# EAGLE design Grove - Button x2 (EAGLE 7.3.0)
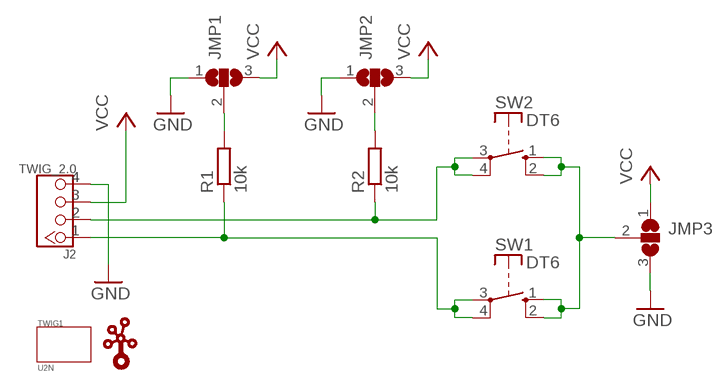
[diagram p0: schematic, sheet 1]

## Parts
J2  TWIG_2.0  [2.0_1X4]
JMP1  SJ2W  [SJ_2]
JMP2  SJ2W  [SJ_2]
JMP3  SJ2W  [SJ_2]
R1  10k  R-EU_R0805  [R0805]
R2  10k  R-EU_R0805  [R0805]
SW1  DT6  [DT6]
SW2  DT6  [DT6]
TWIG1  U2N  [U2N]
U$1  TWIGLOGOTWIGLOGO_SMALL  [TWIGLOGO_SMALL]

## Nets
GND: J2.4 JMP1.1 JMP2.1 JMP3.3
N$1: J2.2 R2.1 SW2.3(P) SW2.4(P)
N$2: J2.1 R1.1 SW1.3(P) SW1.4(P)
N$3: JMP2.2 R2.2
N$4: JMP3.2 SW1.1(S) SW1.2(S) SW2.1(S) SW2.2(S)
N$6: JMP1.2 R1.2
VCC: J2.3 JMP1.3 JMP2.3 JMP3.1

## Library data of the parts
J2 = CONNECTER:TWIG_2.0
JMP1-JMP3 = jumper:SJ2W: SMD solder JUMPER
R1 R2 = rcl:R-EU_: RESISTOR, European symbol
SW1 SW2 = switch-misc:DT: ITT SWITCH
TWIG1 = twig_template1:U2N
U$1 = seeedleo:TWIGLOGO

## Board
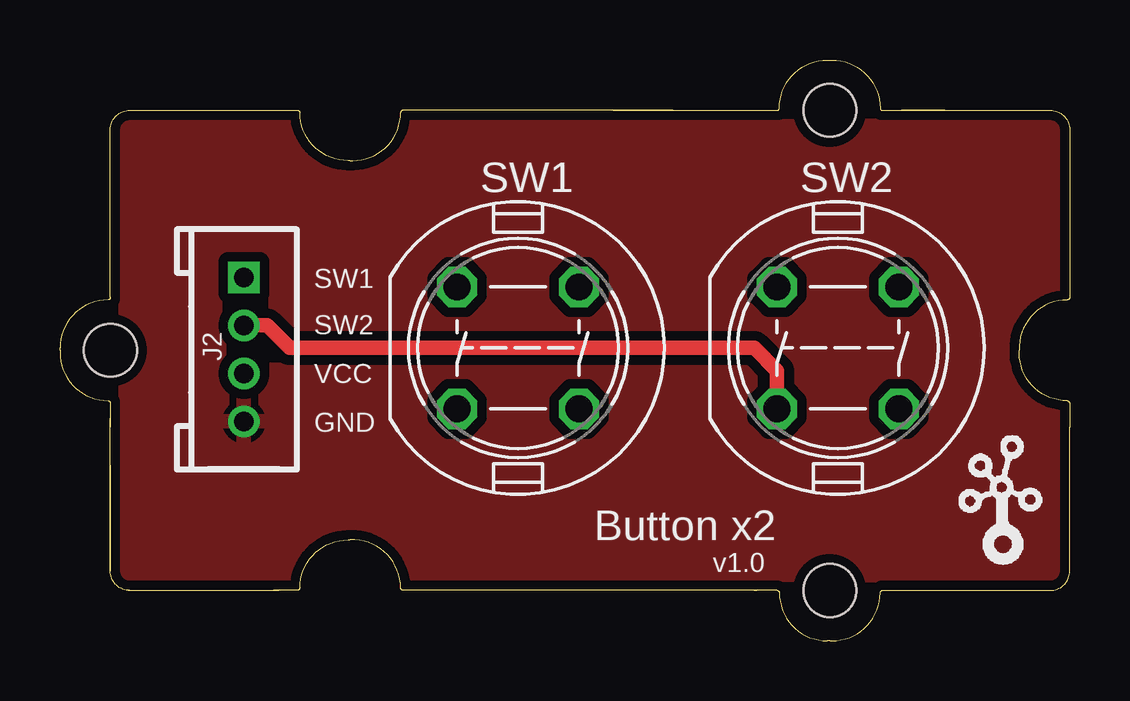
[diagram p1: board, top side]
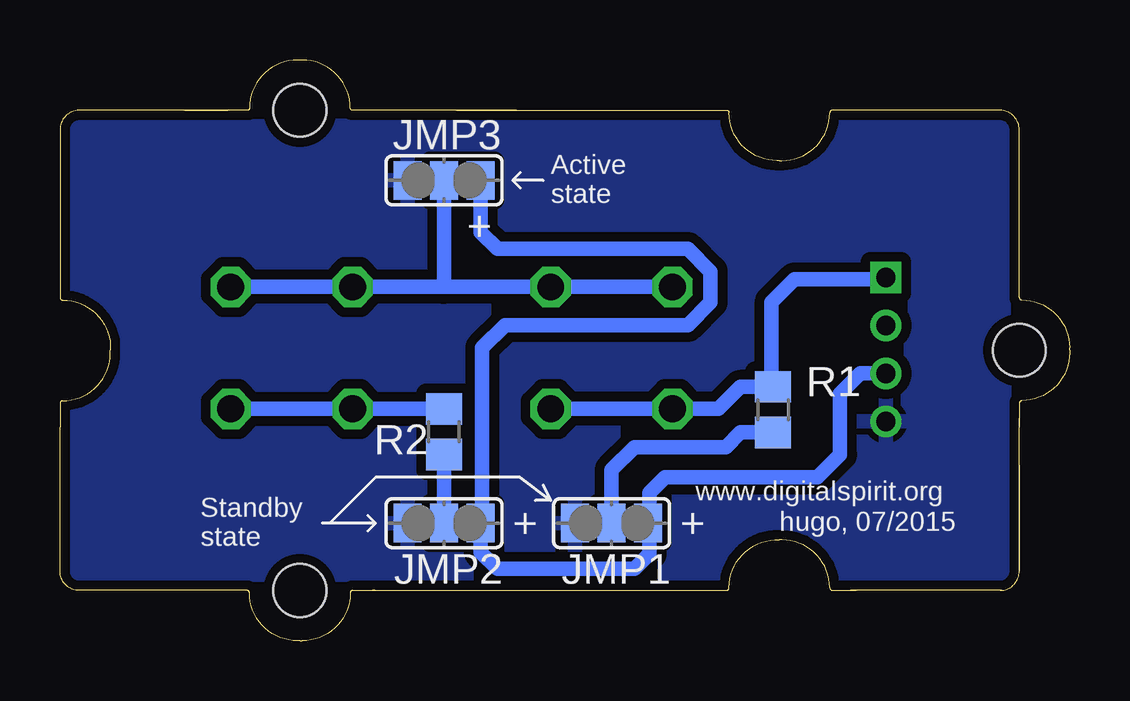
[diagram p2: board, bottom side, seen from below]

Size 42.09 x 24.2 mm. Coordinates in mm from the lower left corner, seen from the top.
Copper layers (1*16): Top 0.035mm / dielectric 1.5mm / Bottom 0.035mm
Design rules "SeeedStudio_rule_no_angle_090911": minimum track width 6mil, minimum drill 12mil, track to track 6mil, track to pad 6mil, pad to pad 6mil, via to via 6mil, smd to smd 0mil, copper to edge 10mil, drill to drill 10mil, minimum pad ring 10mil, minimum via ring 6mil, stop-mask expansion 2mil, vias tented up to drill 100mil, thermal gap 10mil

### Footprints (pad centres in the part's own frame; a part is rotated, then mirrored left to right if it is on the bottom)
2.0_1X4 = drill 0.8 pad 1.27 square: 1 -3,0 | drill 0.8 pad 1.27: 2 -1,0; 3 1,0; 4 3,0
SJ_2 = smd 1.168 x 1.6: 1 -1.524,0; 2 0,0; 3 1.524,0
R0805 = smd 1.3 x 1.5: 1 -0.95,0; 2 0.95,0
DT6 = drill 1.118 octagon: 1 -2.54,2.54; 2 2.54,2.54; 3 2.54,-2.54; 4 -2.54,-2.54
U2N = hole 2.2: 10.453,-10.42; 10.453,9.58; -19.535,-0.415

### Placement (x,y rotation side)
J2  7.67,12.14 270 top
JMP1  19.1,4.9 0 bottom
JMP2  26.08,4.9 0 bottom
JMP3  26.08,19.19 180 bottom
R1  12.36,9.63 270 bottom
R2  26.08,8.71 270 bottom
SW1  19.1,12.2 0 top
SW2  32.43,12.2 0 top
TWIG1  21.64,12.52 0 top
U$1  37.07,3.05 0 top

### Tracks (layer width: path | path; a pad name or v marks a point on that pad's centre or on a via)
GND
  pour Top (isolate 0.406): -0.21,24.46 43.86,24.46 43.86,-1.45 -0.21,-1.45
  pour Bottom (isolate 0.406): -0.21,24.46 43.86,24.46 43.86,-1.58 -0.21,-1.58
N$1
  Top 0.61: J2.2 8.63,13.14 9.57,12.2 28.94,12.2 29.89,11.25 SW2.4
  Bottom 0.61: SW2.3 SW2.4 R2.1
N$2
  Bottom 0.61: SW1.3 SW1.4 14.65,9.66 13.73,10.58 R1.1 12.43,10.64 12.43,14.11 11.48,15.06 7.74,15.06 J2.1
N$3
  Bottom 0.127: 24.49,4.9 JMP2.2
  Bottom 0.61: R2.2 JMP2.2
N$4
  Bottom 0.127: JMP3.2 27.67,19.19
  Bottom 0.61: SW1.1 SW1.2 26.08,14.74 | 26.08,14.74 SW2.1 SW2.2 | JMP3.2 26.08,14.74
N$6
  Bottom 0.127: 17.51,4.9 JMP1.2
  Bottom 0.61: R1.2 13.73,8.68 14.33,8.07 18.14,8.07 19.1,7.12 JMP1.2
VCC
  Bottom 0.61: J2.3 8.73,11.14 9.57,10.3 9.57,7.76 10.52,6.8 16.87,6.8 17.51,6.17 17.51,4.96 JMP1.3 17.51,4.84 17.51,3.63 18.14,2.99 23.86,2.99 24.56,3.69 JMP2.3 24.49,4.96 24.49,12.2 23.54,13.15 15.92,13.15 14.97,14.11 14.97,15.38 15.92,16.33 23.86,16.33 24.56,17.03 JMP3.1

### Text on the board
tPlace: SW1 | SW2 | VCC | GND | Button x2 | v1.0
bNames: Active / state | + | www.digitalspirit.org | hugo, 07/2015 | + | + | Standby / state